# EasyEDA Pro project ProPrj_桌面数控电源New_2025-02-12.epro, schematic Schematic1
Board Name: 主板; Create Date: 2025-01-30; Page Name: P1; Project Name: 桌面数控电源New; Schematic Name: Schematic1; Update Date: 2025-02-07; Company: 嘉立创EDA; Page Size: A4; Version: V1.0
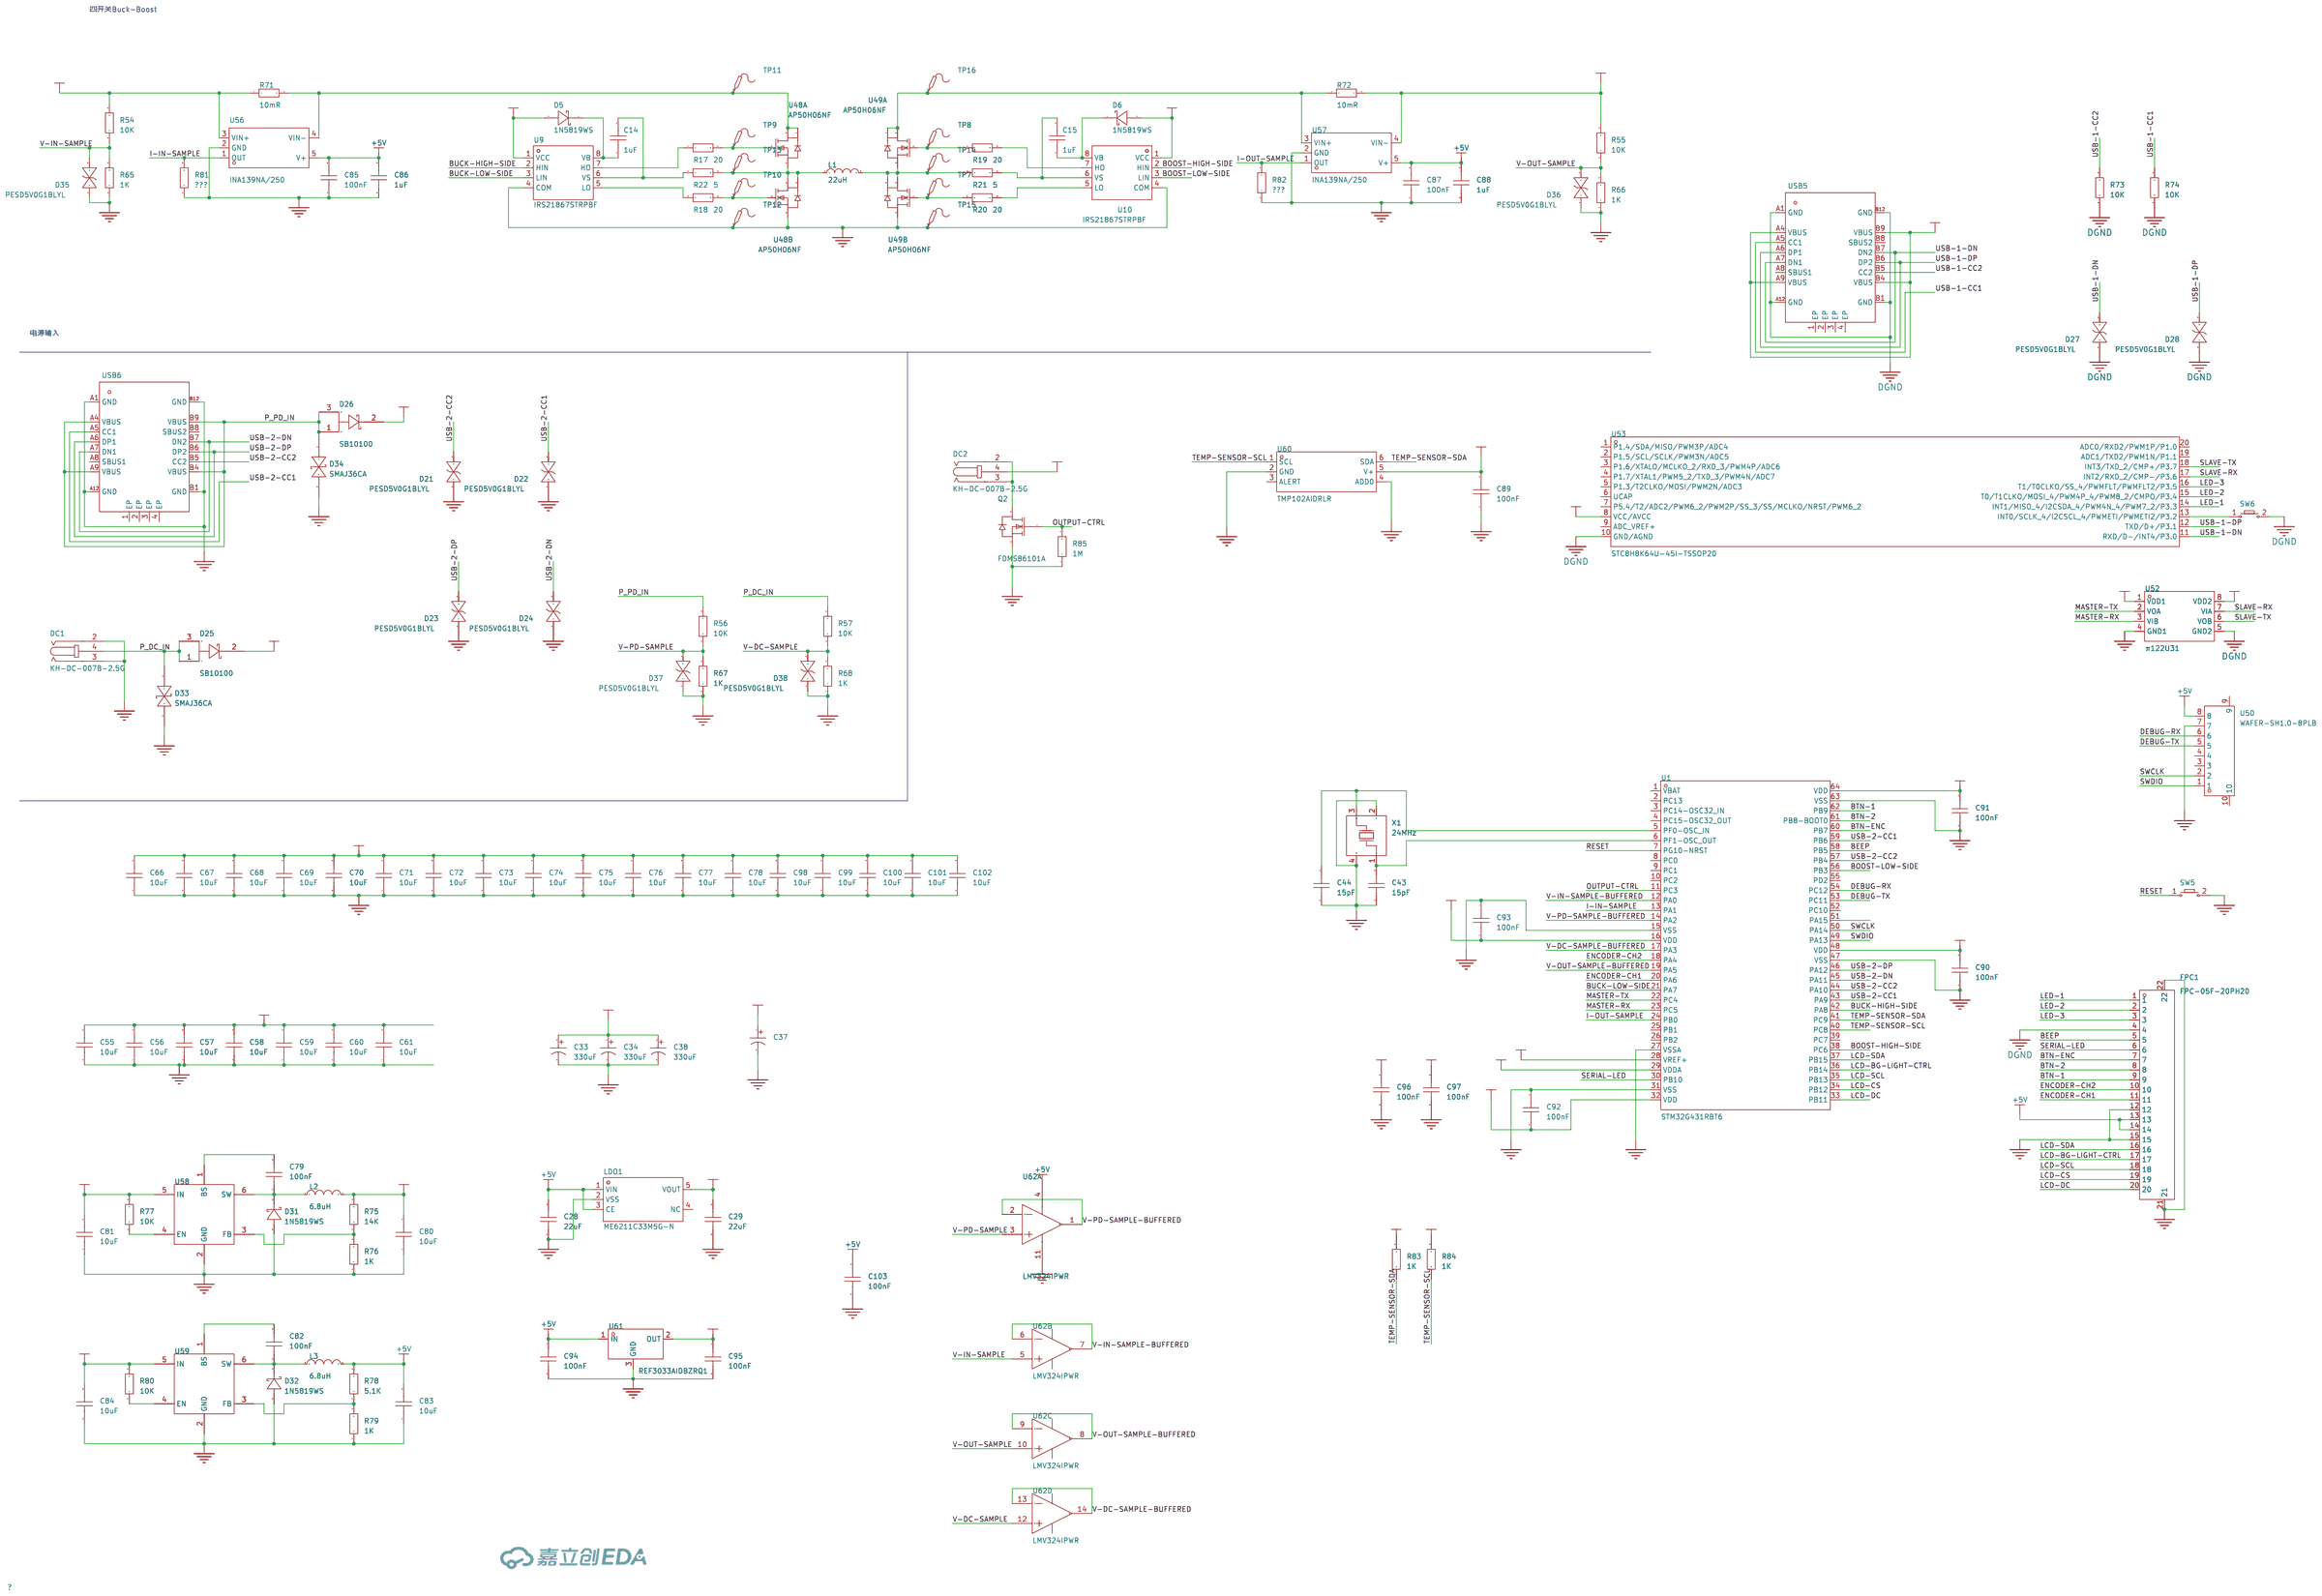
[diagram p0: schematic sheet]

## Parts
C14  1uF  [C0603]
C15  1uF  [C0603]
C28  22uF  [C0603]
C29  22uF  [C0603]
C33  330uF  [CAP-SMD_BD10.0-L10.3-W10.3-FD]
C34  330uF  [CAP-SMD_BD10.0-L10.3-W10.3-FD]
C37  330uF  [CAP-SMD_BD10.0-L10.3-W10.3-FD]
C38  330uF  [CAP-SMD_BD10.0-L10.3-W10.3-FD]
C43  15pF  [C0402]
C44  15pF  [C0402]
C55  10uF  [C1206]
C56  10uF  [C1206]
C57  10uF  [C1206]
C58  10uF  [C1206]
C59  10uF  [C1206]
C60  10uF  [C1206]
C61  10uF  [C1206]
C66  10uF  [C1206]
C67  10uF  [C1206]
C68  10uF  [C1206]
C69  10uF  [C1206]
C70  10uF  [C1206]
C71  10uF  [C1206]
C72  10uF  [C1206]
C73  10uF  [C1206]
C74  10uF  [C1206]
C75  10uF  [C1206]
C76  10uF  [C1206]
C77  10uF  [C1206]
C78  10uF  [C1206]
C79  100nF  [C0402]
C80  10uF  [C1206]
C81  10uF  [C1206]
C82  100nF  [C0402]
C83  10uF  [C1206]
C84  10uF  [C1206]
C85  100nF  [C0402]
C86  1uF  [C0402]
C87  100nF  [C0402]
C88  1uF  [C0402]
C89  100nF  [C0402]
C90  100nF  [C0402]
C91  100nF  [C0402]
C92  100nF  [C0402]
C93  100nF  [C0402]
C94  100nF  [C0402]
C95  100nF  [C0402]
C96  100nF  [C0402]
C97  100nF  [C0402]
C98  10uF  [C1206]
C99  10uF  [C1206]
C100  10uF  [C1206]
C101  10uF  [C1206]
C102  10uF  [C1206]
C103  100nF  [C0402]
D5  1N5819WS  [SOD-323_L1.6-W1.3-LS2.6-RD-1]
D6  1N5819WS  [SOD-323_L1.6-W1.3-LS2.6-RD-1]
D21  PESD5V0G1BLYL  [DFN1006-2L-BI-1]
D22  PESD5V0G1BLYL  [DFN1006-2L-BI-1]
D23  PESD5V0G1BLYL  [DFN1006-2L-BI-1]
D24  PESD5V0G1BLYL  [DFN1006-2L-BI-1]
D25  SB10100  [TO-277_3P-L5.4-W4.0-LS6.5-TR]
D26  SB10100  [TO-277_3P-L5.4-W4.0-LS6.5-TR]
D27  PESD5V0G1BLYL  [DFN1006-2L-BI-1]
D28  PESD5V0G1BLYL  [DFN1006-2L-BI-1]
D31  1N5819WS  [SOD-323_L1.6-W1.3-LS2.6-RD-1]
D32  1N5819WS  [SOD-323_L1.6-W1.3-LS2.6-RD-1]
D33  SMAJ36CA  [SMA_L4.4-W2.8-LS5.1-BI]
D34  SMAJ36CA  [SMA_L4.4-W2.8-LS5.1-BI]
D35  PESD5V0G1BLYL  [DFN1006-2L-BI-1]
D36  PESD5V0G1BLYL  [DFN1006-2L-BI-1]
D37  PESD5V0G1BLYL  [DFN1006-2L-BI-1]
D38  PESD5V0G1BLYL  [DFN1006-2L-BI-1]
DC1  KH-DC-007B-2.5G  [DC-IN-TH_KH-DC-007B-2.1G]
DC2  KH-DC-007B-2.5G  [DC-IN-TH_KH-DC-007B-2.1G]
FPC1  FPC-05F-20PH20  [FPC-SMD_20P-P0.50_XUNPU_FPC-05F-20PH20]
L1  22uH  [IND-SMD_L18.3-W17.0]
L2  6.8uH  [IND-SMD_L4.0-W4.0]
L3  6.8uH  [IND-SMD_L4.0-W4.0]
LDO1  ME6211C33M5G-N  [SOT-23-5_L3.0-W1.7-P0.95-LS2.8-BL]
Q2  FDMS86101A  [POWER56_L5.0-W6.0-P1.27-LS6.6-BL]
R17  20  [R0603]
R18  20  [R0603]
R19  20  [R0603]
R20  20  [R0603]
R21  5  [R0603]
R22  5  [R0603]
R54  10K  [R0402]
R55  10K  [R0402]
R56  10K  [R0402]
R57  10K  [R0402]
R65  1K  [R0402]
R66  1K  [R0402]
R67  1K  [R0402]
R68  1K  [R0402]
R71  10mR  [R2010]
R72  10mR  [R2010]
R73  10K  [R0402]
R74  10K  [R0402]
R75  14K  [R0402]
R76  1K  [R0402]
R77  10K  [R0402]
R78  5.1K  [R0402]
R79  1K  [R0402]
R80  10K  [R0402]
R81  ???  [R0402]
R82  ???  [R0402]
R83  1K  [R0402]
R84  1K  [R0402]
R85  1M  [R0402]
SW5  -  [Key_SMD_3x4x2]
SW6  -  [Key_SMD_3x4x2]
TP7  -  [Test-Point-0.5mm]
TP8  -  [Test-Point-0.5mm]
TP9  -  [Test-Point-0.5mm]
TP10  -  [Test-Point-0.5mm]
TP11  -  [Test-Point-0.5mm]
TP12  -  [Test-Point-0.5mm]
TP13  -  [Test-Point-0.5mm]
TP14  -  [Test-Point-0.5mm]
TP15  -  [Test-Point-0.5mm]
TP16  -  [Test-Point-0.5mm]
U1  STM32G431RBT6  [LQFP-64_L10.0-W10.0-P0.50-LS12.0-BL]
U9  IRS21867STRPBF  [SOIC-8_L5.0-W4.0-P1.27-LS6.0-BL]
U10  IRS21867STRPBF  [SOIC-8_L5.0-W4.0-P1.27-LS6.0-BL]
U48  AP50H06NF  [DFN-8_L6.0-W5.0-P1.27-LS6.2-BL_STL50DN6F7]  (sections 1,2)
U49  AP50H06NF  [DFN-8_L6.0-W5.0-P1.27-LS6.2-BL_STL50DN6F7]  (sections 1,2)
U50  WAFER-SH1.0-8PLB  [CONN-SMD_8P-P1.00_XUNPU_WAFER-SH1.0-8PLB]
U52  π122U31  [SOIC-8_L4.9-W3.9-P1.27-LS6.0-BL]
U53  STC8H8K64U-45I-TSSOP20  [TSSOP-20_L6.5-W4.4-P0.65-LS6.5-BL]
U56  INA139NA/250  [TSOT-23-5_L2.9-W1.6-P0.95-LS2.8-BR]
U57  INA139NA/250  [TSOT-23-5_L2.9-W1.6-P0.95-LS2.8-BR]
U58  -  [SOT-23-6_L2.9-W1.6-P0.95-LS2.8-BR]
U59  -  [SOT-23-6_L2.9-W1.6-P0.95-LS2.8-BR]
U60  TMP102AIDRLR  [SOT-563_L1.6-W1.2-P0.50-LS1.6-BR]
U61  REF3033AIDBZRQ1  [SOT-23-3_L2.9-W1.3-P1.90-LS2.4-BR]
U62  LMV324IPWR  [TSSOP-14_L5.0-W4.4-P0.65-LS6.4-BL]  (sections 1,2,3,4)
USB5  -  [USB_TYPE-C-16P]
USB6  -  [USB_TYPE-C-16P]
X1  24MHz  [OSC-SMD_4P-L3.2-W2.5-BL]

## Library data of the parts
C14 C15 C28 C29 = CAP_0603: Supplier Footprint: 0603
C33 C34 C37 C38 = VZT331M1HTR-1010: 容值:330uF;精度:±20%;额定电压:50V;纹波电流:-;等效串联电阻:-;; LCSC Part Name: 330uF ±20% 50V; Supplier Part: C249985; Manufacturer: lelon(立隆); Supplier Footprint: SMD,D10xL10mm; Datasheet: https://atta.szlcsc.com/upload/public/pdf/source/20181120/C249985_6A8D5999BFF14B278468C4882E1D699D.pdf; Supplier: LCSC; Tolerance: ±20%; Rated Voltage: 50V; φD: 10mm; L: 10mm; Lifetime @ Temp: 2000hrs@105℃; Operating Temperature: -45℃~+105℃
C43 C44 C79 C82 C85-C97 C103 = CAP_0402: Supplier Footprint: 0402
C55-C61 C66-C78 C80 C81 C83 C84 C98-C102 = CAP_1206: Supplier Footprint: 1206
D5 D6 D31 D32 = 1N5819WS: 直流反向耐压(Vr):40V;平均整流电流(Io):1A;正向压降(Vf):580mV@1A;反向电流(Ir):50uA@40V;; LCSC Part Name: 40V 1A 580mV@1A; Supplier Part: C2903903; Manufacturer: GOODWORK(固得沃克); Supplier Footprint: SOD-323; Datasheet: https://atta.szlcsc.com/upload/public/pdf/source/20220114/BF6ECC8ED918A91A4FEA6F25B6F03A5F.pdf; Supplier: LCSC; Reverse Voltage (Vr): 40V; Average Rectified Current (Io): 1A; Forward Voltage (Vf@If): 580mV@1A; Reverse Leakage Current (Ir): 50uA@40V
D21-D24 D27 D28 D35-D38 = PESD5V0G1BLYL: Supplier Part: C552551; Manufacturer: Nexperia(安世); Supplier Footprint: DFN1006-2; JLCPCB Part Class: 扩展库; Datasheet: https://atta.szlcsc.com/upload/public/pdf/source/20200610/C552551_C9736EA6469B949B40B49F1EFBC48625.pdf; Supplier: LCSC
D25 D26 = SB10100: 二极管配置:独立式;正向压降(Vf):850mV@10A;直流反向耐压(Vr):100V;整流电流:10A;; LCSC Part Name: 电压:100V 电流:10A; Supplier Part: C2891314; Manufacturer: GOODWORK(固得沃克); Supplier Footprint: TO-277; JLCPCB Part Class: 扩展库; Datasheet: https://atta.szlcsc.com/upload/public/pdf/source/20240805/61B603A1DBCC7850C55E8413A9133BDA.pdf; Supplier: LCSC; Diode Configuration: 独立式; Forward Voltage (Vf@If): 850mV@10A; Reverse Voltage (Vr): 100V; Rectified Current: 10A; Reverse Leakage Current (Ir): 20uA
D33 D34 = SMAJ36CA: 反向截止电压(Vrwm):36V;最大钳位电压:58.1V;峰值脉冲电流(Ipp):6.9A;击穿电压:40V;; LCSC Part Name: 双向TVS 36V截止 6.9A峰值脉冲; Supplier Part: C356740; Manufacturer: JJW(捷捷微); Supplier Footprint: SMA(DO-214AC); JLCPCB Part Class: 扩展库; Datasheet: https://atta.szlcsc.com/upload/public/pdf/source/20190118/C364660_B64EB57815AD6306F3CC88F8ECD7A3CF.pdf; Supplier: LCSC; Reverse Stand-Off Voltage (Vrwm): 36V; Maximum Clamping Voltage: 58.1V; Peak Pulse Current (Ipp): 6.9A; Breakdown Voltage: 40V; Reverse Leakage Current (Ir): 1uA; Type: TVS
DC1 DC2 = KH-DC-007B-2.5G: Supplier Part: C2847176; Manufacturer: kinghelm(金航标); Datasheet: https://atta.szlcsc.com/upload/public/pdf/source/20210716/C2847176_DFA33A6703E6E0EAFEE1F667C8C088B1.pdf; Supplier: LCSC
FPC1 = FPC-05F-20PH20: 锁定特性:翻盖式;触点类型:下接;触点数量:20P;间距:0.5mm;安装类型:卧贴;工作温度范围:-25℃~+85℃;; LCSC Part Name: 间距:0.5mm P数:20P 翻盖式 下接; Supplier Part: C2856803; Manufacturer: XUNPU(讯普); Supplier Footprint: SMD,P=0.5mm,卧贴; JLCPCB Part Class: 扩展库; Datasheet: https://atta.szlcsc.com/upload/public/pdf/source/20210922/C2856803_40AC94077DCDAD136B773224EC50E565.pdf; Supplier: LCSC; Locking Feature: 翻盖式; Contact Type: 下接; Number of Contacts: 20P; Pitch: 0.5mm; Mounting Type: 卧贴; FFC, FCB Thickness: 0.3mm; Height Above Board: 2mm; Operating Temperature Range: -25℃~+85℃
L1 = YSPIA1770-220M: 电感值:22uH;精度:±20%;额定电流:8A;饱和电流(Isat):15A;; LCSC Part Name: 22uH ±20% 8A 22.5mΩ; Supplier Part: C2839932; Manufacturer: YJYCOIN(益嘉源); Supplier Footprint: SMD,18.25x17x7mm; Datasheet: https://atta.szlcsc.com/upload/public/pdf/source/20210615/C2839932_33EF3FE61893DB0D450802CD7C52B644.pdf; Supplier: LCSC; Tolerance: ±20%; Rated Current: 8A; Saturation Current (Isat): 15A; DC Resistance (DCR): 22.5mΩ
L2 L3 = SWPA4030S6R8MT: 电感值:6.8uH;精度:±20%;额定电流:1.6A;饱和电流(Isat):2.75A;类型:-;; LCSC Part Name: 6.8uH ±20% 2.75A; Supplier Part: C62684; Manufacturer: Sunlord(顺络); Supplier Footprint: SMD,4x4mm; JLCPCB Part Class: 扩展库; Datasheet: https://atta.szlcsc.com/upload/public/pdf/source/20231024/317626D2AA2F8AB4113C1875E432E6E1.pdf; Supplier: LCSC; Tolerance: ±20%; Rated Current: 1.6A; Current - Saturation(Isat): 2.75A; DC Resistance(DCR): 117mΩ
LDO1 = ME6211C33M5G-N: 输出类型:固定;输出极性:正;最大输入电压:6V;输出电压:3.3V;输出电流:500mA;电源纹波抑制比(PSRR):70dB;; Supplier Part: C82942; Manufacturer: MICRONE(南京微盟); Supplier Footprint: SOT-23-5; Datasheet: https://atta.szlcsc.com/upload/public/pdf/source/20170918/C82942_1505727073070976520.pdf; Supplier: LCSC; Output Type: 固定; Output Polarity: 正; Number of Outputs: 1; Maximum Input Voltage: 6V; Output Voltage: 3.3V; Dropout Voltage: 260mV@(200mA); Output Current: 500mA; Power Supply Rejection Ratio (PSRR): 70dB
Q2 = FDMS86101A: 类型:1个N沟道;漏源电压(Vdss):100V;连续漏极电流(Id):13A；60A;功率(Pd):2.5W；104W;导通电阻(RDS(on)@Vgs,Id):8mΩ@13A,10V;阈值电压(Vgs(th)@Id):4V@250uA;; Manufacturer: onsemi(安森美); Supplier: LCSC; Supplier Part: C605041; Type: 1个N沟道; Drain Source On Resistance (RDS(on)@Vgs,Id): 8mΩ@13A,10V; Operating Temperature: -55℃~+150℃@(Tj); Power Dissipation (Pd): 2.5W；104W; Supplier Footprint: PQFN-8(5x6); LCSC Part Name: 1个N沟道 耐压:100V 电流:13A 电流:60A; Continuous Drain Current (Id): 13A；60A; Drain Source Voltage (Vdss): 100V; Input Capacitance (Ciss@Vds): 4.12nF@50V; Datasheet: https://atta.szlcsc.com/upload/public/pdf/source/20201223/C605041_64C030A07F807D1EB3F0172DA3C65175.pdf; Gate Threshold Voltage (Vgs(th)@Id): 4V@250uA; Total Gate Charge (Qg@Vgs): 58nC@10V
R17-R22 = Res_0603: Supplier Footprint: 0603
R54-R57 R65-R68 R73-R85 = Res_0402: Supplier Footprint: 0402
R71 R72 = Res_2010: Supplier Footprint: 2010
SW5 SW6 = Key_SMD_3x4x2: Supplier Footprint: SMD
TP7-TP16 = Test-Point: Test Point 测试点
U1 = STM32G431RBT6: CPU内核:ARM-M系列;CPU最大主频:170MHz;应用领域:-;; LCSC Part Name: 带DSP和FPU的170MHz主流ARM Cortex-M4 MCU，具有128 KB Flash存储器、数学加速器和中等模拟电平集成; Supplier Part: C431633; Manufacturer: ST(意法半导体); Supplier Footprint: LQFP-64(10x10); JLCPCB Part Class: 扩展库; Datasheet: https://atta.szlcsc.com/upload/public/pdf/source/20190925/C431633_8068E60CC825A086DCCD86A4BDED9458.pdf; Supplier: LCSC; CPU Core: ARM-M系列; CPU Maximum Speed: 170MHz; Program Storage Size: 128KB; Number of I/O: 52; ADC (Bit): 12bit; DAC (Bit): 12bit; Low Voltage Detection Threshold: 1.71V~3.6V
U9 U10 = IRS21867STRPBF: 驱动配置:半桥;负载类型:MOSFET；IGBT;电源电压:10V~20V;峰值灌电流:4A;峰值拉电流:4A;; LCSC Part Name: 半桥 IGBT MOSFET 灌:4A 拉:4A; Supplier Part: C52290; Manufacturer: Infineon(英飞凌); Supplier Footprint: SOIC-8-150mil; Datasheet: https://atta.szlcsc.com/upload/public/pdf/source/20161024/1477287953380.pdf; Supplier: LCSC; Driven Configuration: 半桥; Number of Drivers: 2; loadtype: MOSFET；IGBT; Supply Voltage: 10V~20V; Peak Output Current(sink): 4A; Peak Output Current(source): 4A; Rise Time: 22ns; Fall Time: 18ns; Operating Temperature: -40℃~+150℃@(Tj)
U48 U49 = AP50H06NF: 类型:2个N沟道;漏源电压(Vdss):60V;连续漏极电流(Id):50A;功率(Pd):3.6W;导通电阻(RDS(on)@Vgs,Id):11mΩ@10V,12A;阈值电压(Vgs(th)@Id):1.6V@250uA;栅极电荷(Qg@Vgs):19.3nC@4.5V;输入电容(Ciss@Vds):2.423nF@15V;反向传输电容(Crss@Vds):97pF@15V;工作温度:-55℃~+150℃@(Tj);; LCSC Part Name: 2个N沟道 60V 50A; Supplier Part: C3011487; Manufacturer: APM(永源微电子); Supplier Footprint: PDFN-8L(5x6); Datasheet: https://atta.szlcsc.com/upload/public/pdf/source/20220507/6FFA72FD32045DF7099F6472134FB63D.pdf; Supplier: LCSC; Type: 2个N沟道; Drain Source Voltage (Vdss): 60V; Continuous Drain Current (Id): 50A; Power Dissipation (Pd): 3.6W; Drain Source On Resistance (RDS(on)@Vgs,Id): 11mΩ@10V,12A; Gate Threshold Voltage (Vgs(th)@Id): 1.6V@250uA; Total Gate Charge (Qg@Vgs): 19.3nC@4.5V; Input Capacitance (Ciss@Vds): 2.423nF@15V; Reverse Transfer Capacitance (Crss@Vds): 97pF@15V; Operating Temperature: -55℃~+150℃@(Tj)
U50 = WAFER-SH1.0-8PLB: 间距:1mm;插针结构:1x8P;排数:1;每排PIN数:8;公母:公型插针;安装方式:立贴;额定电流:1A;工作温度范围:-25℃~+85℃;; LCSC Part Name: 1mm 1x8P 立贴 加盖; Supplier Part: C3029338; Manufacturer: XUNPU(讯普); Supplier Footprint: SMD,P=1mm; JLCPCB Part Class: 扩展库; Datasheet: https://atta.szlcsc.com/upload/public/pdf/source/20220527/2BC543D78697EB0EE4D2C73A161B184B.pdf; Supplier: LCSC; Pitch: 1mm; Pins Structure: 1x8P; Number of Rows: 1; Number of PINs Per Row: 8; Gender: 公型插针; Mounting Style: 立贴; Current Rating (Max): 1A; Operating Temperature Range: -25℃~+85℃
U52 = π122U31: LCSC Part Name: 增强型ESD 3.0kVrms/6.0kVrms 150Kbps双通道数字隔离器; Supplier Part: C471590; Manufacturer: 2Pai Semi(荣湃); Supplier Footprint: SOIC-8; JLCPCB Part Class: 扩展库; Datasheet: https://atta.szlcsc.com/upload/public/pdf/source/20191223/C471590_0EC0A3D8C50EA147F11BC2F4781C203C.pdf; Supplier: LCSC; Data Rate(Max): 150Kbps; Isolation Voltage(Vrms): 3000; Integrated Power Supply: -；-
U53 = STC8H8K64U-45I-TSSOP20: LCSC Part Name: 宽电压/高速/高可靠/低功耗/强抗静电/较强抗干扰的新一代 8051 单片机; Supplier Part: C5210758; Manufacturer: STC; Supplier Footprint: TSSOP-20; JLCPCB Part Class: 扩展库; Datasheet: https://atta.szlcsc.com/upload/public/pdf/source/20241226/4D2D43D1C972E3DE0CD105735CEEAD95.pdf; Supplier: LCSC
U56 U57 = INA139NA/250: INA139 36V、高侧、高速、电流输出电流分流监控器; Supplier Part: C189201; Manufacturer: TI(德州仪器); Supplier Footprint: SOT-23-5; JLCPCB Part Class: 扩展库; Datasheet: https://www.ti.com/cn/lit/gpn/ina139; Supplier: LCSC; Supply Voltage: 2.7V~40V; Operating Temperature: -40℃~+125℃
U58 U59 = ME3116: 功能类型:降压型;同步整流:-;输出通道数:-;拓扑结构:-;输入电压:-;输出电流(最大值):-;开关频率:-;; LCSC Part Name: 降压型; Supplier Part: C97643; Manufacturer: MICRONE(南京微盟); Manufacturer Part: ME3116AM6G; Supplier Footprint: SOT-23-6; JLCPCB Part Class: Extended Part; Datasheet: https://atta.szlcsc.com/upload/public/pdf/source/20170322/1490151692992.pdf; Supplier: LCSC; Function: 降压型
U60 = TMP102AIDRLR: 温度范围:-40℃~+125℃;精度:±0.5℃;接口类型:I2C;; Supplier Part: C99269; Manufacturer: TI(德州仪器); Supplier Footprint: SOT-563; JLCPCB Part Class: 扩展库; Datasheet: https://www.ti.com/cn/lit/gpn/tmp102; Supplier: LCSC; Temperature range: -40℃~+125℃; Resolution: ±0.5℃; Supply Voltage: 1.4V~3.6V; Standby Current: 1uA; Interface Type: I2C
U61 = REF3033AIDBZRQ1: 输出类型:固定;输入电压:3.35V~5.5V;输出电压:3.3V;输出电流:25mA;精度:±0.2%;; Supplier Part: C3680001; Manufacturer: TI(德州仪器); Supplier Footprint: SOT-23-3; JLCPCB Part Class: 扩展库; Datasheet: https://www.ti.com/cn/lit/gpn/ref3033-q1; Supplier: LCSC; Output Type: 固定; Input Voltage: 3.35V~5.5V; Output Voltage: 3.3V; Output Current: 25mA; Tolerance: ±0.2%; Temperature Coefficient: 75ppm/℃; Reference Type: 串联; Supply Current: 50uA; Noise - 1/10Hz to 10Hz: 36uVp-p; Noise - 10Hz to 10kHz: 105uVrms; Operating Temperature: -40℃~+85℃@(Ta)
U62 = LMV324IPWR: 放大器数:四路;轨到轨:-;增益带宽积(GBP):1MHz;压摆率(SR):1V/us;输入偏置电流(Ib):15nA;; LCSC Part Name: 低电压轨到轨输出运算放大器; Supplier Part: C398929; Manufacturer: TI(德州仪器); Supplier Footprint: TSSOP-14; JLCPCB Part Class: 扩展库; Datasheet: https://www.ti.com/cn/lit/gpn/lmv358; Supplier: LCSC; Number of Circuits: 四路; Gain Bandwidth Product(GBP): 1MHz; Slew Rate(SR): 1V/us; Current - Input Bias(Ib): 15nA; Output Current: 40mA; Operating Temperature: -40℃~+125℃
USB5 USB6 = USB_TYPE-C-16P: Supplier Footprint: SMD
X1 = X322525MOB4SI: 频率:25MHz;频率公差:±10ppm;负载电容:12pF;; LCSC Part Name: 25MHz ±10ppm 12pF YSX321SL; Supplier Part: C9006; Manufacturer: YXC(扬兴晶振); Supplier Footprint: SMD3225-4P; JLCPCB Part Class: 基础库; Datasheet: https://atta.szlcsc.com/upload/public/pdf/source/20210329/C112971_1F611BDC486E193C1706F6D8EB5AA189.pdf; Supplier: LCSC; Crystal Type: 贴片无源晶振; Frequency Tolerance: ±10ppm; Frequency Stability: ±30ppm; Load Capacitance: 12pF; Operating Temperature: -40℃~+85℃

## Nets
+3.3V: C29.2 C89.2 C90.2 C91.2 C92.2 C93.2 C96.1 LDO1.5(VOUT) R83.2 R84.2 U1.16(VDD) U1.29(VDDA) U1.32(VDD) U1.48(VDD) U1.64(VDD) U52.1(VDD1) U60.5(V+)
+3.3V-REF: C95.1 C97.1 U1.28(VREF+) U61.2(OUT)
+5V: C28.2 C83.2 C85.2 C86.2 C87.2 C88.2 C94.1 C103.1 FPC1.13 FPC1.14 L3.2 LDO1.1(VIN) LDO1.3(CE) R78.2 U50.8 U56.5(V+) U57.5(V+) U61.1(IN) U62.4(VCC+)
+12V: C80.2 D5.2(A) D6.2(A) L2.2 R75.2 U9.1(VCC) U10.1(VCC)
D5V: U52.8(VDD2) U53.8(VCC/AVCC) USB5.A4(VBUS) USB5.A9(VBUS) USB5.B4(VBUS) USB5.B9(VBUS)
DGND: D27.1 D28.1 FPC1.4 R73.1 R74.1 SW6.2 U52.5(GND2) U53.10(GND/AGND) USB5.A1(GND) USB5.A12(GND) USB5.B1(GND) USB5.B12(GND)
GND: C28.1 C29.1 C33.2 C34.2 C37.2 C38.2 C43.1 C44.1 C55.1 C56.1 C57.1 C58.1 C59.1 C60.1 C61.1 C66.1 C67.1 C68.1 C69.1 C70.1 C71.1 C72.1 C73.1 C74.1 C75.1 C76.1 C77.1 C78.1 C80.1 C81.1 C83.1 C84.1 C85.1 C86.1 C87.1 C88.1 C89.1 C90.1 C91.1 C92.1 C93.1 C94.2 C95.2 C96.2 C97.2 C98.1 C99.1 C100.1 C101.1 C102.1 C103.2 D21.1 D22.1 D23.1 D24.1 D31.2(A) D32.2(A) D33.2 D34.2 D35.1 D36.1 D37.1 D38.1 DC1.2 DC1.3 FPC1.12 FPC1.15 FPC1.21 FPC1.22 LDO1.2(VSS) Q2.2(S) R65.1 R66.1 R67.1 R68.1 R76.1 R79.1 R81.1 R82.1 R85.1 SW5.2 TP12.1 TP15.1 U1.15(VSS) U1.27(VSSA) U1.31(VSS) U1.47(VSS) U1.63(VSS) U9.4(COM) U10.4(COM) U48.3(S) U49.3(S) U50.7 U52.4(GND1) U56.2(GND) U57.2(GND) U58.2(GND) U59.2(GND) U60.2(GND) U60.4(ADD0) U61.3(GND) U62.11(GND) USB6.A1(GND) USB6.A12(GND) USB6.B1(GND) USB6.B12(GND) X1.2(GND) X1.4(GND)
VIN: C37.1 C55.2 C56.2 C57.2 C58.2 C59.2 C60.2 C61.2 C81.2 C84.2 D25.2 D26.2 R54.2 R71.1 R77.2 R80.2 U56.3(VIN+) U58.5(IN) U59.5(IN)
BEEP: FPC1.5 U1.58(PB5)
BOOST-HIGH-SIDE: U1.38(PC6) U10.2(HIN)
BOOST-LOW-SIDE: U1.56(PB3) U10.3(LIN)
BTN-1: FPC1.9 U1.62(PB9)
BTN-2: FPC1.8 U1.61(PB8-BOOT0)
BTN-ENC: FPC1.7 U1.60(PB7)
BUCK-HIGH-SIDE: U1.42(PA8) U9.2(HIN)
BUCK-LOW-SIDE: U1.21(PA7) U9.3(LIN)
DEBUG-RX: U1.54(PC12) U50.6
DEBUG-TX: U1.53(PC11) U50.5
ENCODER-CH1: FPC1.11 U1.20(PA6)
ENCODER-CH2: FPC1.10 U1.18(PA4)
I-IN-SAMPLE: R81.2 U1.13(PA1) U56.1(OUT)
I-OUT-SAMPLE: R82.2 U1.24(PB0) U57.1(OUT)
LCD-BG-LIGHT-CTRL: FPC1.17 U1.36(PB14)
LCD-CS: FPC1.19 U1.34(PB12)
LCD-DC: FPC1.20 U1.33(PB11)
LCD-SCL: FPC1.18 U1.35(PB13)
LCD-SDA: FPC1.16 U1.37(PB15)
LED-1: FPC1.1 U53.14(INT1/MISO_4/I2CSDA_4/PWM4N_4/PWM7_2/P3.3)
LED-2: FPC1.2 U53.15(T0/T1CLKO/MOSI_4/PWM4P_4/PWM8_2/CMPO/P3.4)
LED-3: FPC1.3 U53.16(T1/T0CLKO/SS_4/PWMFLT/PWMFLT2/P3.5)
MASTER-RX: U1.23(PC5) U52.3(VIB)
MASTER-TX: U1.22(PC4) U52.2(VOA)
OUTPUT-CTRL: Q2.1(G) R85.2 U1.11(PC3)
P_DC_IN: D25.1 D25.3 D33.1 DC1.4 R57.2
P_PD_IN: D26.1 D26.3 D34.1 R56.2 USB6.A4(VBUS) USB6.A9(VBUS) USB6.B4(VBUS) USB6.B9(VBUS)
RESET: SW5.1 U1.7(PG10-NRST)
SERIAL-LED: FPC1.6 U1.30(PB10)
SLAVE-RX: U52.7(VIA) U53.17(INT2/RXD_2/CMP-/P3.6)
SLAVE-TX: U52.6(VOB) U53.18(INT3/TXD_2/CMP+/P3.7)
SWCLK: U1.50(PA14) U50.2
SWDIO: U1.49(PA13) U50.1
TEMP-SENSOR-SCL: R84.1 U1.40(PC8) U60.1(SCL)
TEMP-SENSOR-SDA: R83.1 U1.41(PC9) U60.6(SDA)
USB-1-CC1: R74.2 USB5.A5(CC1)
USB-1-CC2: R73.2 USB5.B5(CC2)
USB-1-DN: D27.2 U53.11(RXD/D-/INT4/P3.0) USB5.A7(DN1) USB5.B7(DN2)
USB-1-DP: D28.2 U53.12(TXD/D+/P3.1) USB5.A6(DP1) USB5.B6(DP2)
USB-2-CC1: D22.2 U1.43(PA9) U1.59(PB6) USB6.A5(CC1)
USB-2-CC2: D21.2 U1.44(PA10) U1.57(PB4) USB6.B5(CC2)
USB-2-DN: D24.2 U1.45(PA11) USB6.A7(DN1) USB6.B7(DN2)
USB-2-DP: D23.2 U1.46(PA12) USB6.A6(DP1) USB6.B6(DP2)
V-DC-SAMPLE: D38.2 R57.1 R68.2 U62.12(IN4+)
V-DC-SAMPLE-BUFFERED: U1.17(PA3) U62.13(IN4-) U62.14(OUT4)
V-IN-SAMPLE: D35.2 R54.1 R65.2 U62.5(IN2+)
V-IN-SAMPLE-BUFFERED: U1.12(PA0) U62.6(IN2-) U62.7(OUT2)
V-OUT-SAMPLE: D36.2 R55.1 R66.2 U62.10(IN3+)
V-OUT-SAMPLE-BUFFERED: U1.19(PA5) U62.8(OUT3) U62.9(IN3-)
V-PD-SAMPLE: D37.2 R56.1 R67.2 U62.3(IN1+)
V-PD-SAMPLE-BUFFERED: U1.14(PA2) U62.1(OUT1) U62.2(IN1-)
VOUT: C33.1 C34.1 C38.1 C66.2 C67.2 C68.2 C69.2 C70.2 C71.2 C72.2 C73.2 C74.2 C75.2 C76.2 C77.2 C78.2 C98.2 C99.2 C100.2 C101.2 C102.2 DC2.4 R55.2 R72.2 U57.4(VIN-)
$1N8031: R17.1 U9.7(HO)
$1N8032: R18.1 U9.5(LO)
$1N8033: C14.1 D5.1(K) U9.8(VB)
$1N8039: R20.2 U10.5(LO)
$1N8040: R19.2 U10.7(HO)
$1N8048: C15.2 R21.2 U10.6(VS)
$1N8049: C14.2 R22.1 U9.6(VS)
$1N8055: R17.2 TP9.1 U48.2(G)
$1N8056: R18.2 TP10.1 U48.4(G)
$1N8057: R20.1 TP7.1 U49.4(G)
$1N8058: R19.1 TP8.1 U49.2(G)
$1N8059: R72.1 TP16.1 U49.7(D) U49.8(D) U57.3(VIN+)
$1N8062: L1.1 R22.2 TP13.1 U48.1(S) U48.5(D) U48.6(D)
$1N8063: L1.2 R21.1 TP14.1 U49.1(S) U49.5(D) U49.6(D)
$1N8076: R71.2 TP11.1 U48.7(D) U48.8(D) U56.4(VIN-)
$1N8100: C15.1 D6.1(K) U10.8(VB)
$1N11837: DC2.2 DC2.3 Q2.3(D)
$1N12416: C44.2 U1.5(PF0-OSC_IN) X1.3(OSC2)
$1N12417: C43.2 U1.6(PF1-OSC_OUT) X1.1(OSC1)
$1N15013: C79.1 D31.1(K) L2.1 U58.6(SW)
$1N15041: C79.2 U58.1(BS)
$1N15176: R75.1 R76.2 U58.3(FB)
$1N15271: R77.1 U58.4(EN)
$1N15727: C82.1 D32.1(K) L3.1 U59.6(SW)
$1N15730: C82.2 U59.1(BS)
$1N15737: R78.1 R79.2 U59.3(FB)
$1N15756: R80.1 U59.4(EN)
$1N22283: SW6.1 U53.13(INT0/SCLK_4/I2CSCL_4/PWMETI/PWMETI2/P3.2)

Not connected (* = marked no-connect by the designer): LDO1 4(NC); U1 1(VBAT) 2(PC13) 3(PC14-OSC32_IN) 4(PC15-OSC32_OUT) 8(PC0) 9(PC1) 10(PC2) 25(PB1) 26(PB2) 39(PC7) 51(PA15) 52(PC10) 55(PD2); U50 3 4 9 10; U53 1(P1.4/SDA/MISO/PWM3P/ADC4) 2(P1.5/SCL/SCLK/PWM3N/ADC5) 3(P1.6/XTALO/MCLKO_2/RXD_3/PWM4P/ADC6) 4(P1.7/XTAL1/PWM5_2/TXD_3/PWM4N/ADC7) 5(P1.3/T2CLKO/MOSI/PWM2N/ADC3) 6(UCAP) 7(P5.4/T2/ADC2/PWM6_2/PWM2P/SS_3/SS/MCLKO/NRST/PWM6_2) 9(ADC_VREF+) 19(ADC1/TXD2/PWM1N/P1.1) 20(ADC0/RXD2/PWM1P/P1.0); U60 3(ALERT); USB5 1(EP) 2(EP) 3(EP) 4(EP) A8(SBUS1) B8(SBUS2); USB6 1(EP) 2(EP) 3(EP) 4(EP) A8(SBUS1) B8(SBUS2)

## Notes on the sheet
- 四开关Buck-Boost
- 电源输入
